# EasyEDA schematic 1-Schematic_5G23����Ŵ��� copy.json
TITLE: 5G23; REV: 1.0; Date: 2022-04-18; Sheet: 1/1; Drawn By: BH2VGM; Company: NEU-ISE
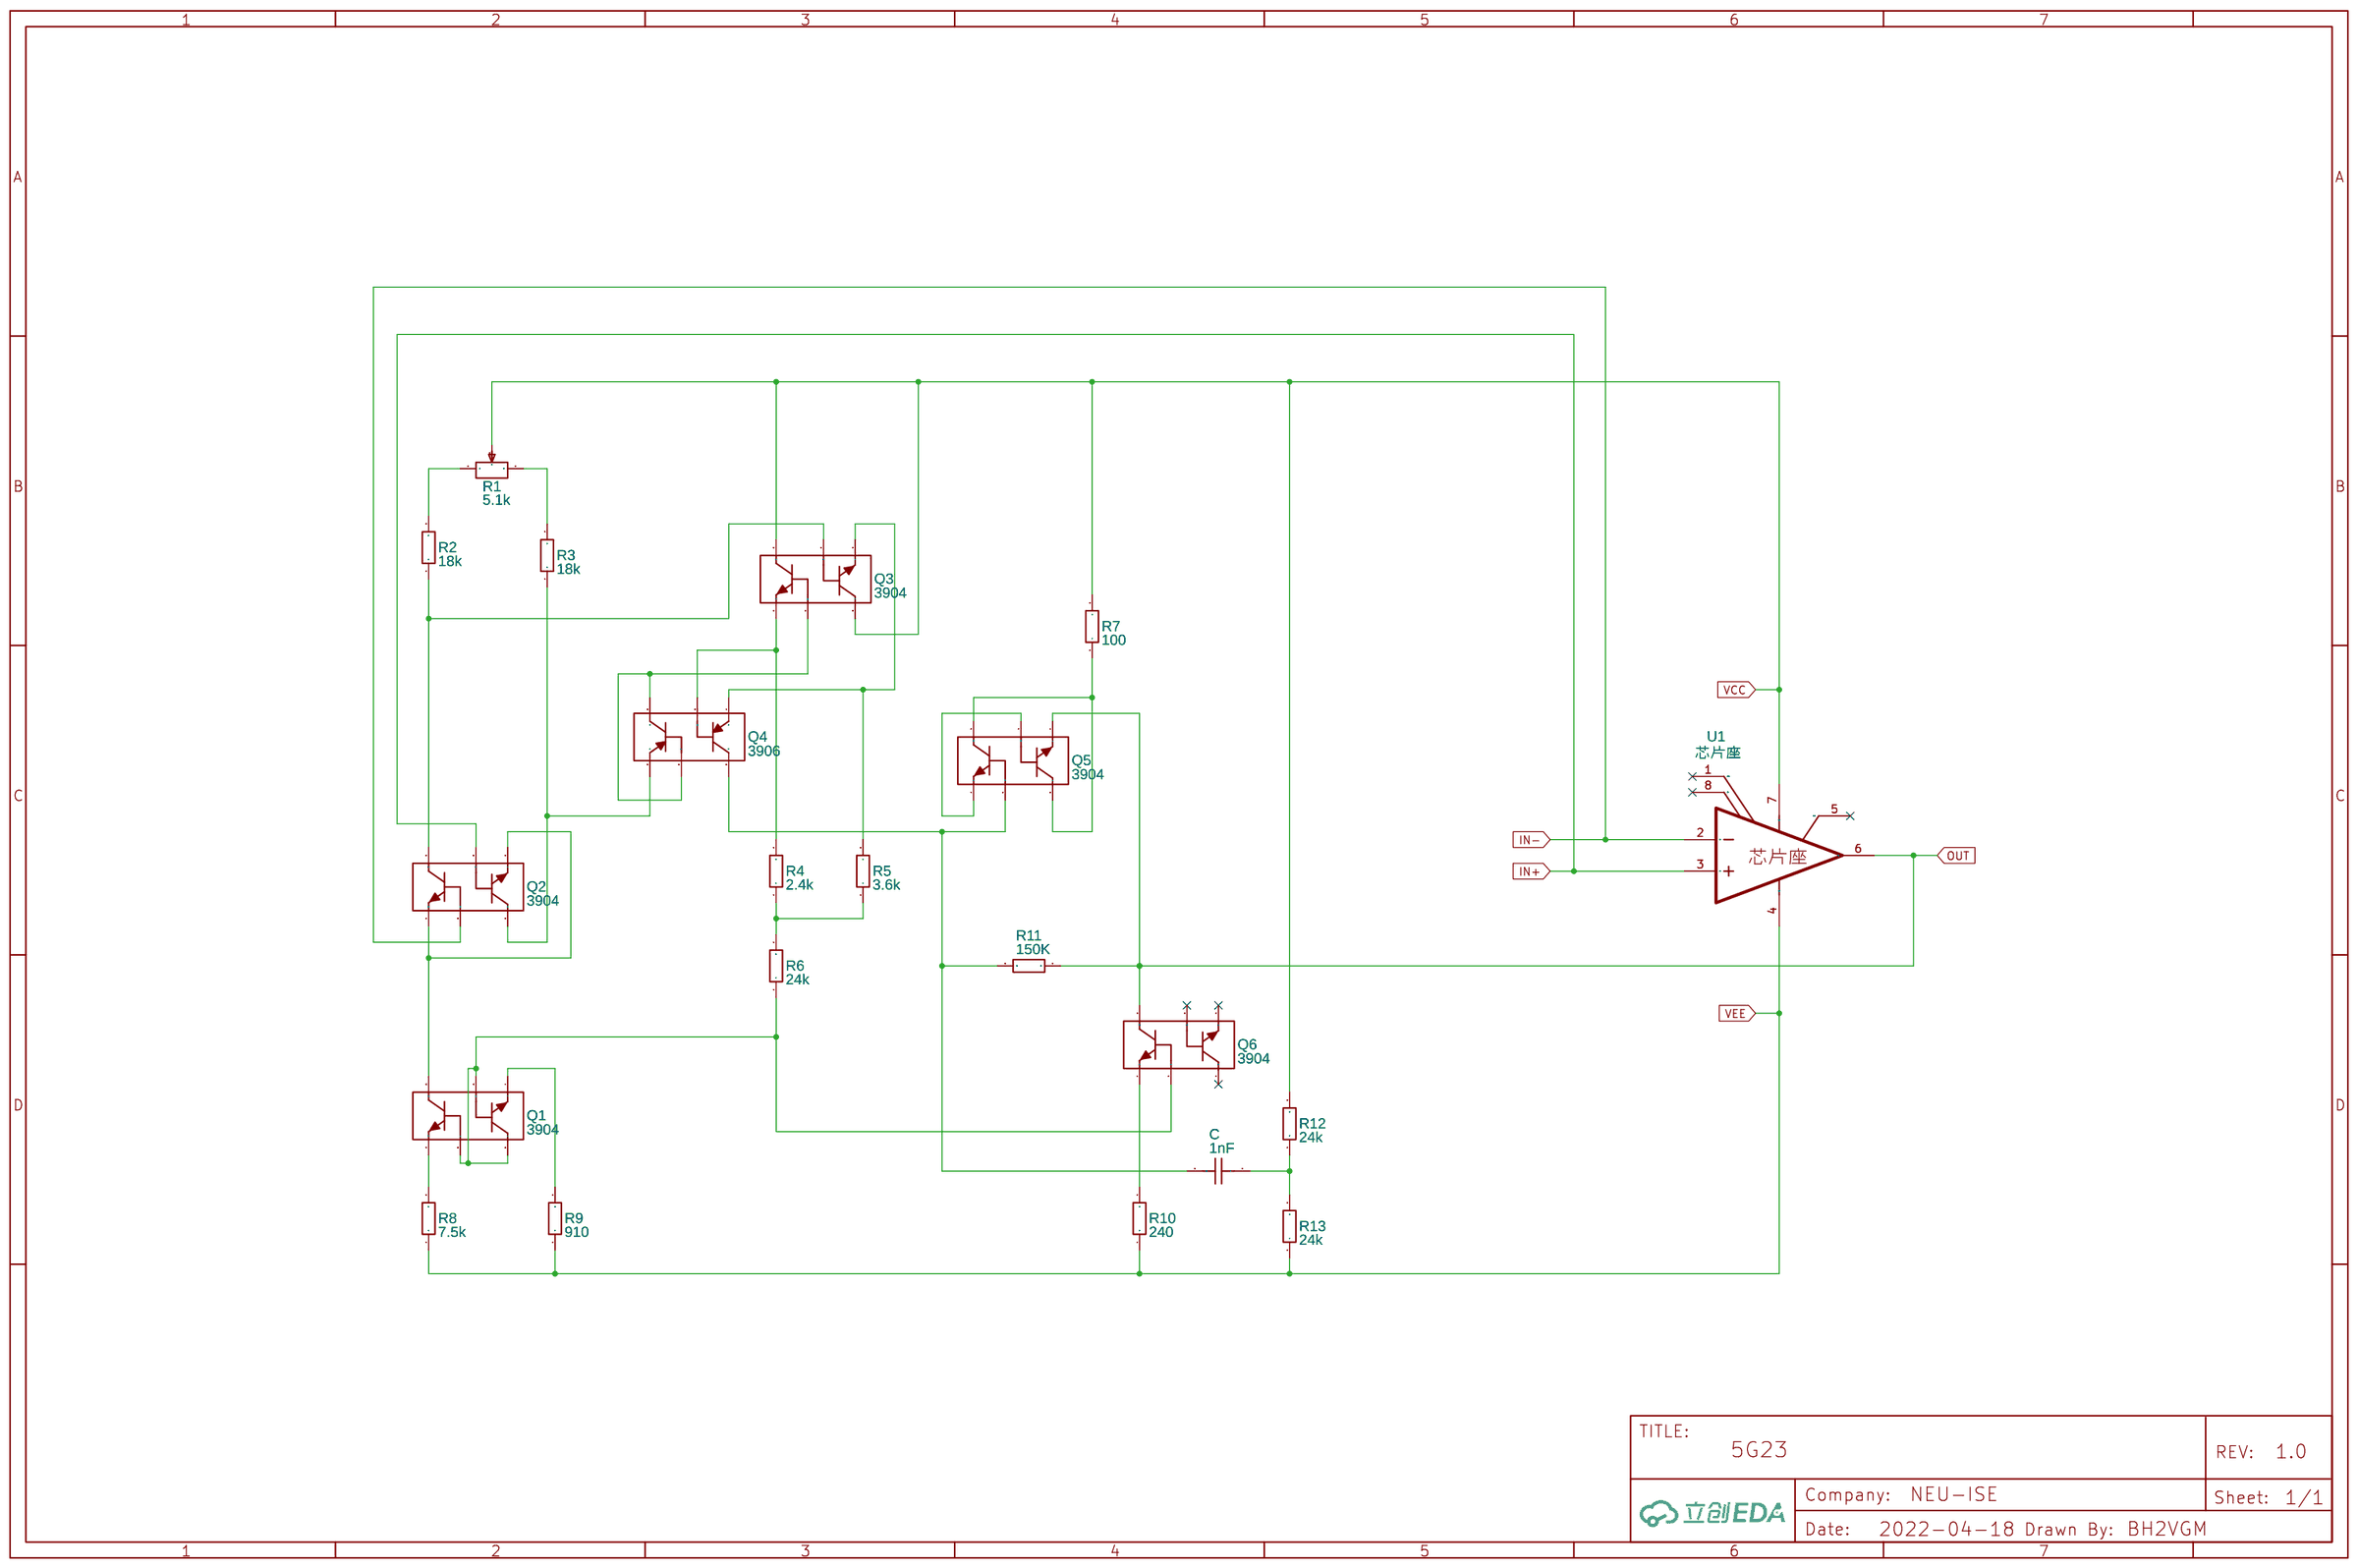
[diagram p0: schematic sheet]

## Parts
C  1nF  [C0603]
Q1  3904  [SOT-363]
Q2  3904  [SOT-363]
Q3  3904  [SOT-363]
Q4  3906  [SOT-363]
Q5  3904  [SOT-363]
Q6  3904  [SOT-363]
R1  5.1k  [RES-ADJ-SMD_VG039NCH]
R2  18k  [R0603]
R3  18k  [R0603]
R4  2.4k  [R0603]
R5  3.6k  [R0603]
R6  24k  [R0603]
R7  100  [R0603]
R8  7.5k  [R0603]
R9  910  [R0603]
R10  240  [R0603]
R11  150K  [R0603]
R12  24k  [R0603]
R13  24k  [R0603]
U1  芯片座  [DIP8]

## Library data of the parts
C = 1NF-C0603: Supplier: LCSC; Supplier Part: C2940049; Manufacturer: null; Manufacturer Part: 1nF-C0603; Contributor: LCSC; JLCPCB Part Class: Extended Part
Q1-Q3 Q5 Q6 = MMDT3904: Supplier: LCSC; Manufacturer: DIODES; Manufacturer Part: MMDT3904-7-F; Supplier Part: C83572; JLCPCB Part Class: Extended Part; Contributor: king13478509115
Q4 = MMDT3906: Supplier: LCSC; Supplier Part: C779248; Manufacturer: MCC(Micro Commercial Components); Manufacturer Part: MMDT3906-TP; Contributor: king13478509115; JLCPCB Part Class: Extended Part
R1 = VG039NCHXTB204: Supplier: LCSC; Manufacturer: HDK; Supplier Part: C128551; Resistance(Ohms): 200K; Resistance (Ohms): 200K; JLCPCB Part Class: Extended Part
R2-R13 = 0805: Supplier: LCSC; Supplier Part: C9900012715; Manufacturer: null; link: https://atta.szlcsc.comnull; Contributor: LCSC; JLCPCB Part Class: Extended Part
U1 = UA741CP: Supplier: LCSC; Supplier Part: C2057458; Manufacturer: TI(德州仪器); Manufacturer Part: UA741CDR; Contributor: king13478509115

## Nets
VCC: Q3.3(C) Q3.6(C) R1.2 R7.2 R12.2 U1.7(VCC+)
VEE: R8.1 R9.1 R10.1 R13.1 U1.4(VCC-)
IN+: Q2.5(B) U1.3(+IN)
IN-: Q2.2(B) U1.2(-IN)
OUT: Q5.4(E) Q6.6(C) R11.1 U1.6(OUT)
Net-(C-1): C.1 Q4.3(C) Q5.2(B) R11.2
Net-(C-2): C.2 R12.1 R13.2
Net-(Q1-1): Q1.1(E) R8.2
Net-(Q1-2): Q1.2(B) Q1.3(C) Q1.5(B) Q6.2(B) R6.1
Net-(Q1-4): Q1.4(E) R9.2
Net-(Q1-6): Q1.6(C) Q2.1(E) Q2.4(E)
Net-(Q2-3): Q2.3(C) Q4.1(E) R3.1
Net-(Q2-6): Q2.6(C) Q3.5(B) R2.1
Net-(Q3-1): Q3.1(E) Q4.5(B) R4.2
Net-(Q3-2): Q3.2(B) Q4.2(B) Q4.6(C)
Net-(Q3-4): Q3.4(E) Q4.4(E) R5.2
Net-(Q5-1): Q5.1(E) Q5.5(B)
Net-(Q5-3): Q5.3(C) Q5.6(C) R7.1
Net-(Q6-1): Q6.1(E) R10.2
Net-(R1-1): R1.1 R2.2
Net-(R1-3): R1.3 R3.2
Net-(R4-1): R4.1 R5.1 R6.2

Not connected (* = marked no-connect by the designer): Q6 3(C)* 4(E)* 5(B)*; U1 1(OFFSET N1)* 5(OFFSET N2)* 8(NC)*
